# EAGLE design MCP73831T_LiPo_Charger (EAGLE 8.3.2)
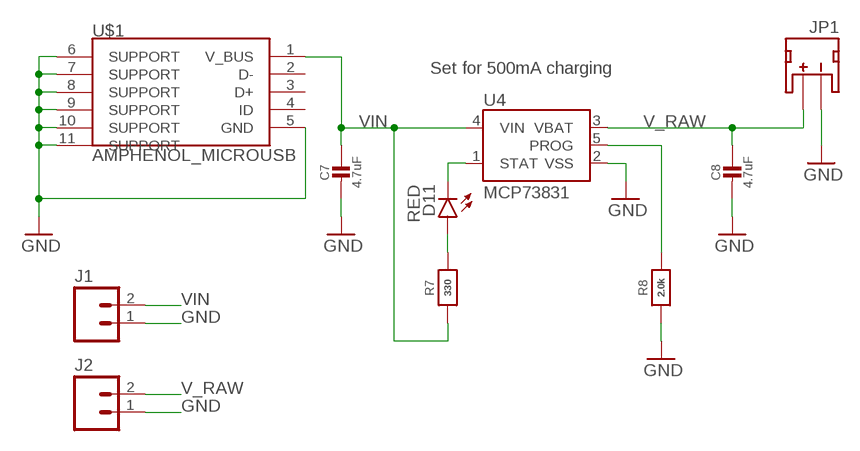
[diagram p0: schematic, sheet 1]

## Parts
C7  4.7uF  CAP_CERAMIC0805-NOOUTLINE  [0805-NO]
C8  4.7uF  CAP_CERAMIC0805-NOOUTLINE  [0805-NO]
D11  RED  LED-RED0603  [LED-0603]
J1  M02PTH  [1X02]
J2  M02PTH  [1X02]
JP1  JST  JST_2MM_MALE  [JST-2-SMD@1]
R7  330  RESISTOR_0805MP  [_0805MP]
R8  2.0k  RESISTOR_0805MP  [_0805MP]
U4  MCP73831  [SOT23-5]
U$1  AMPHENOL_MICROUSB  [AMPHENOL_MICROUSB]

## Nets
GND: C7.2 C8.2 J1.1 J2.1 JP1.1(-) R8.1 U4.2(VSS) U$1.5(GND) U$1.6(SUPPORT) U$1.7(SUPPORT) U$1.8(SUPPORT) U$1.9(SUPPORT) U$1.10(SUPPORT) U$1.11(SUPPORT)
N$1: D11.A R7.2
PROG: R8.2 U4.5(PROG)
STAT: D11.C U4.1(STAT)
V_RAW: C8.1 J2.2 JP1.2(+) U4.3(VBAT)
VIN: C7.1 J1.2 R7.1 U4.4(VIN) U$1.1(V_BUS)
Unconnected: JP1.NC1(PAD1) JP1.NC2(PAD2) U$1.2(D-) U$1.3(D+) U$1.4(ID)

## Notes on the sheet
- Set for 500mA charging

## Library data of the parts
C7 C8 = microbuilder:CAP_CERAMIC: Ceramic Capacitors For new designs, use the packages preceded by an '_' character since they are more reliable: The following footprints should be used on most boards: _0402 - Standard footprint for regular board layouts _0603 - Standard footprint for regular board layouts _0805 - Standard footprint for regular board layouts _1206 - Standard footprint for regular board layouts For extremely tight-pitch boards where space is at a premium, the following 'micro-pitch' footprints can be used (smaller pads, no silkscreen outline, etc.): _0402MP - Micro-pitch footprint for very dense/compact boards _0603MP - Micro-pitch footprint for very dense/compact boards _0805MP - Micro-pitch footprint for very dense/compact boards _1206MP - Micro-pitch footprint for very dense/compact boards
D11 = SparkFun-LED:LED-RED: Assorted Red LEDs LilyPad 1206- DIO-09912 1206- DIO-00809 0603- DIO-00819; PROD_ID: DIO-00819
J1 J2 = SparkFun-Connectors:M02: Standard 2-pin 0.1" header. Use with - straight break away headers ( PRT-00116) - right angle break away headers (PRT-00553) - swiss pins (PRT-00743) - machine pins (PRT-00117) - female headers (PRT-00115) Molex polarized connector foot print use with: PRT-08233 with associated crimp pins and housings. 2.54_SCREWTERM for use with PRT-10571. 3.5mm Screw Terminal footprints for PRT-08084 5mm Screw Terminal footprints for use with PRT-08432
JP1 = SparkFun-Connectors:JST_2MM_MALE: Mates to single-cell LiPo batteries. CONN-08352; PROD_ID: CONN-08352
R7 R8 = microbuilder:RESISTOR: Resistors For new designs, use the packages preceded by an '_' character since they are more reliable: The following footprints should be used on most boards: _0402 - Standard footprint for regular board layouts _0603 - Standard footprint for regular board layouts _0805 - Standard footprint for regular board layouts _1206 - Standard footprint for regular board layouts For extremely tight-pitch boards where space is at a premium, the following 'micro-pitch' footprints can be used (smaller pads, no silkscreen outline, etc.): _0402MP - Micro-pitch footprint for very dense/compact boards _0603MP - Micro-pitch footprint for very dense/compact boards _0805MP - Micro-pitch footprint for very dense/compact boards _1206MP - Micro-pitch footprint for very dense/compact boards
U4 = SparkFun-PowerIC:MCP73831: Miniature single cell, fully integrated Li-Ion, Li-polymer charge management controller http://ww1.microchip.com/downloads/en/DeviceDoc/21984a.pdf IC-09995; PROD_ID: IC-09995
U$1 = sharkdunio:AMPHENOL_MICROUSB

## Board
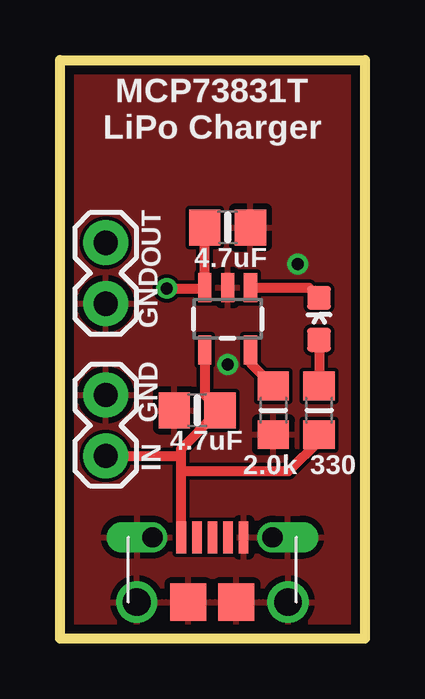
[diagram p1: board, top side]
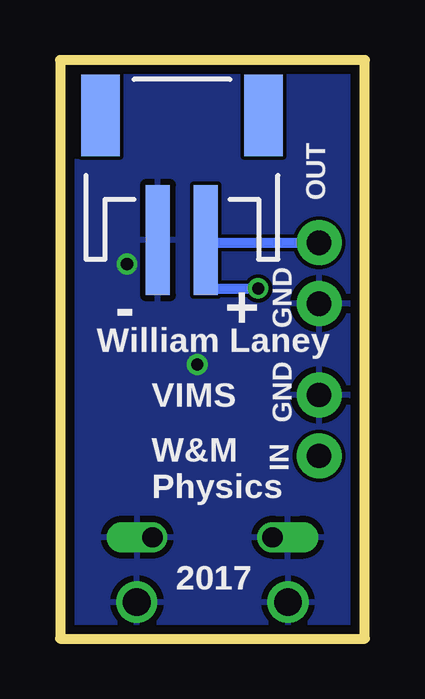
[diagram p2: board, bottom side, seen from below]

Size 12.7 x 24.13 mm. Coordinates in mm from the lower left corner, seen from the top.
Outline: 0,0 0,24.13 12.7,24.13 12.7,0 0,0
Copper layers (1*16): Top 0.0356mm / dielectric 1.5011mm / Bottom 0.0356mm
Design rules "oshpark-2layer": minimum track width 6mil, minimum drill 13mil, track to track 6mil, track to pad 6mil, pad to pad 6mil, via to via 6mil, smd to smd 6mil, copper to edge 15mil, drill to drill 6mil, minimum pad ring 7mil, minimum via ring 7mil, stop-mask expansion 2.5mil, vias tented up to drill 0mil, thermal gap 10mil

### Footprints (pad centres in the part's own frame; a part is rotated, then mirrored left to right if it is on the bottom)
0805-NO = smd 1.3 x 1.5: 1 -0.95,0; 2 0.95,0
LED-0603 = smd 1 x 1: A 0,-0.877; C 0,0.877
1X02 = drill 1.016 pad 1.88: 1 0,0; 2 2.54,0
JST-2-SMD@1 = smd 1 x 4.6: 1 -1,-3.7; 2 1,-3.7 | smd 1.6 x 3.4: NC1 -3.4,1.5; NC2 3.4,1.5
_0805MP = smd 1.2 x 1.3: 1 -1.016,0; 2 1.016,0
SOT23-5 = smd 0.55 x 1.2: 1 -0.95,-1.3; 2 0,-1.3; 3 0.95,-1.3; 4 0.95,1.3; 5 -0.95,1.3
AMPHENOL_MICROUSB = smd 0.4 x 1.35: 1 -1.3,2.7; 2 -0.65,2.7; 3 0,2.7; 4 0.65,2.7; 5 1.3,2.7 | smd 1.5 x 1.55: 6 -1,0; 7 1,0 | drill 0.85 pad 1.25 offset: 8 -2.5,2.7; 9 2.5,2.7 | drill 1.15 pad 1.55: 10 -3.15,0; 11 3.15,0

### Placement (x,y rotation side)
C7  5.71,9.53 180 top
C8  6.99,17.14 0 top
D11  10.79,13.34 0 top
J1  1.91,10.16 270 top
J2  1.91,13.97 90 top
JP1  7.62,20.32 0 bottom
R7  10.79,9.53 90 top
R8  8.89,9.53 90 top
U4  6.99,13.34 180 top
U$1  6.35,1.52 0 top

### Tracks (layer width: path | path; a pad name or v marks a point on that pad's centre or on a via)
GND  (via drill 0.51)
  other vias: 6.99,11.43 9.91,15.62
  pour Top: 0,24.13 12.7,24.13 12.7,0 0,0
  pour Bottom: 0,24.13 12.7,24.13 12.7,0 0,0
N$1
  Top 0.406: D11.A R7.2
PROG
  Top 0.406: U4.5 7.93,11.5 R8.2
STAT
  Top 0.406: U4.1 10.37,14.63 D11.C
V_RAW  (via drill 0.51)
  Top 0.406: C8.1 U4.3 6,14.61 v4.45,14.61
  Bottom 0.406: J2.2 6.51,16.51 JP1.2 6.62,14.61 v4.45,14.61
VIN
  Top 0.406: U4.4 6.04,10.15 C7.1 5.77,8.63 5.05,7.91 5.05,7.62 | 5.05,7.62 5.05,6.99 5.08,6.99 | J1.2 5.05,7.62 | R7.1 10.79,8.26 9.53,6.99 5.08,6.99 | U$1.1 5.05,6.96 5.08,6.99

### Text on the board
tPlace: MCP73831T | LiPo Charger | OUT | 4.7uF | GND | GND | 4.7uF | IN | 2.0k | 330
bPlace: OUT | GND | + | - | William Laney | VIMS | GND | IN | W&M / Physics | 2017
tOrigins: IN
bOrigins: OUT